# EasyEDA Pro project busmaster-v101.eprj, board main-board
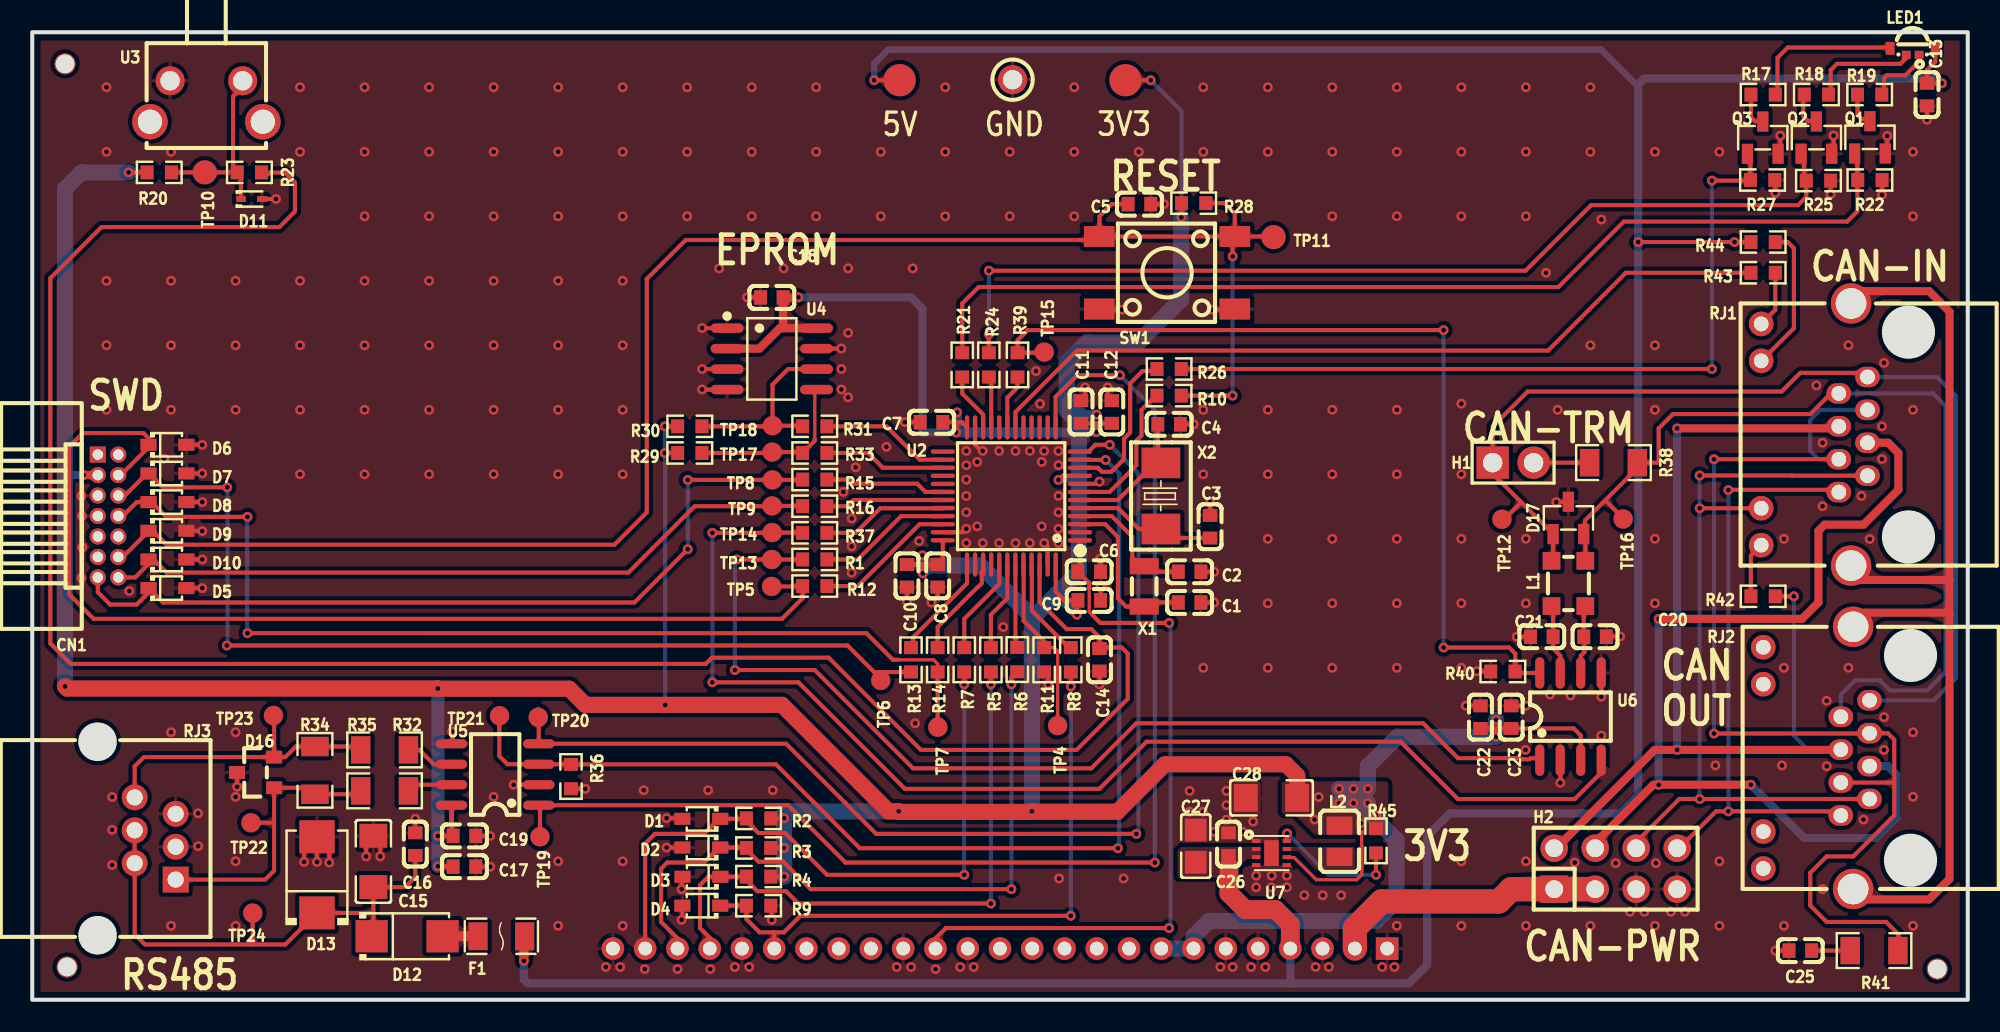
[diagram p6: board, top side]
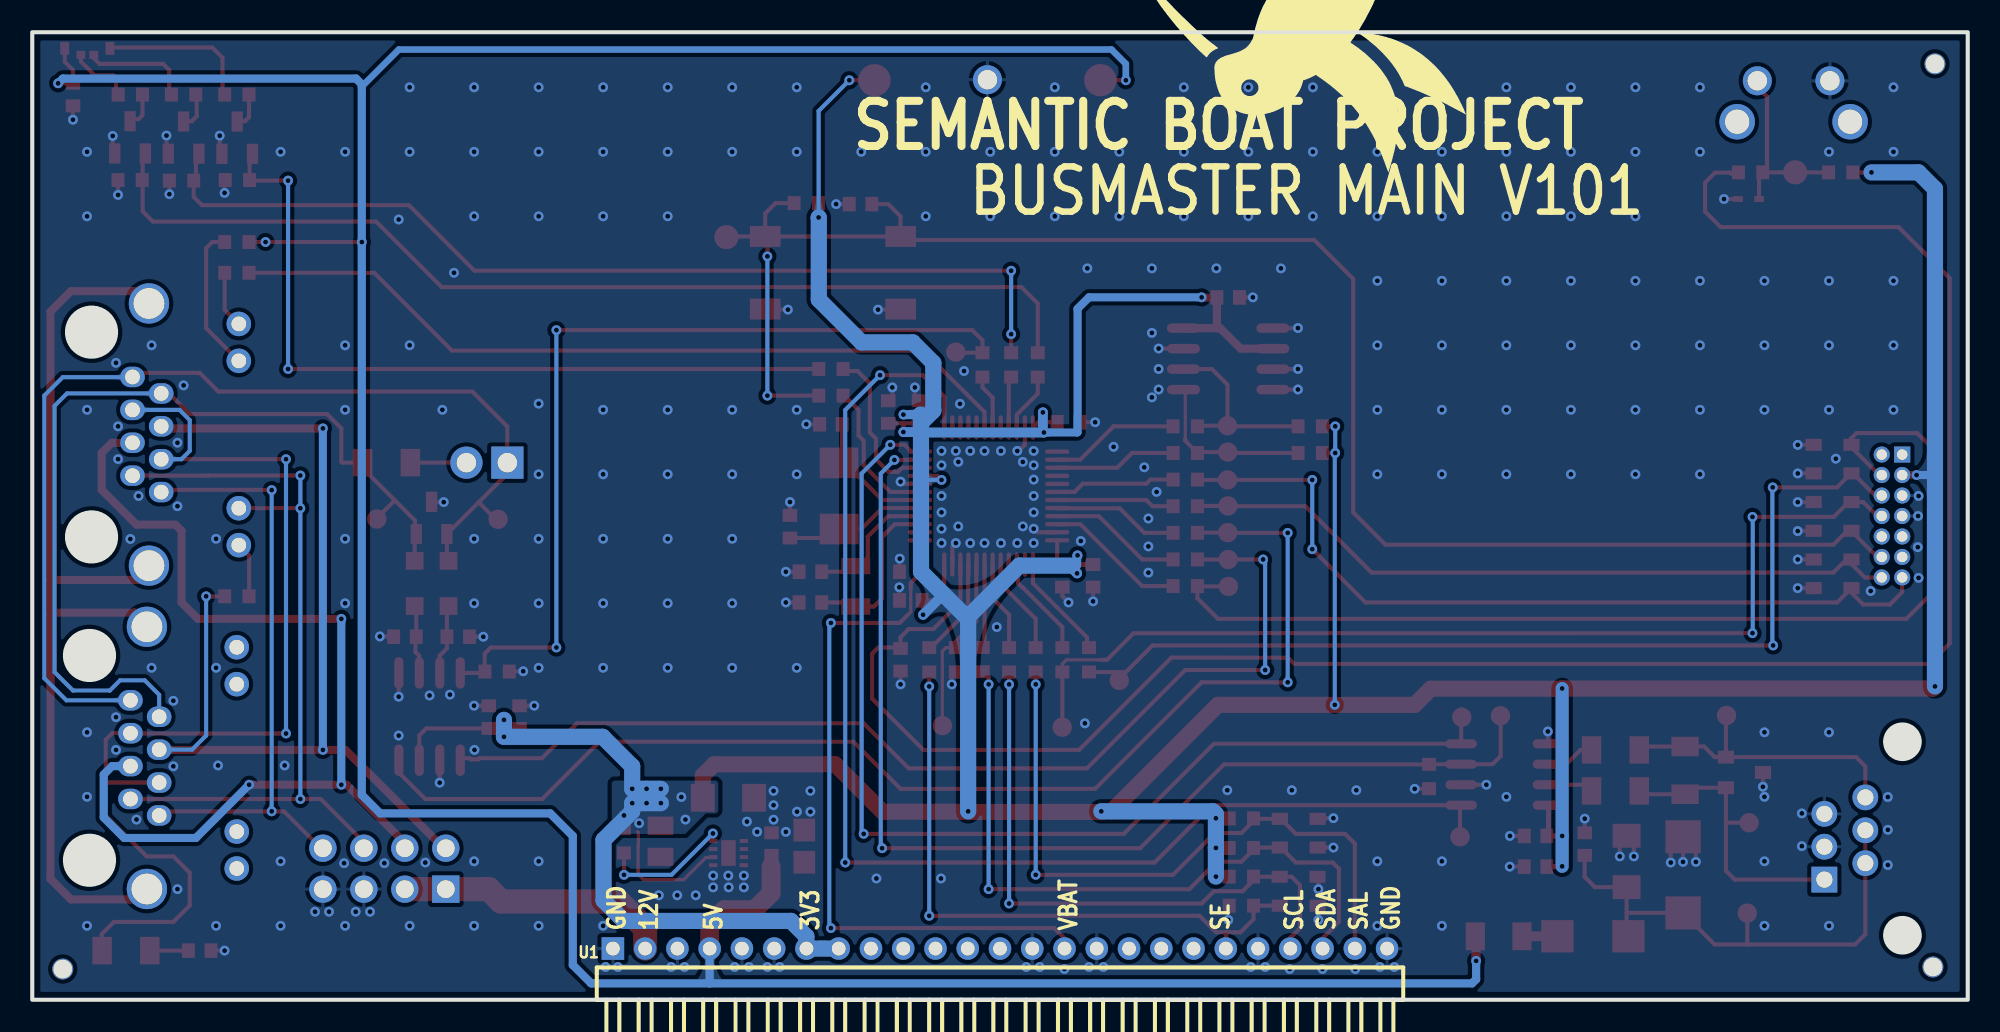
[diagram p7: board, bottom side, seen from below]

Outline 120 x 60 mm; copper layers: Top Layer, Inner1, Inner2, Bottom Layer. Coordinates in mm from the lower left corner of the outline.
Outline path: rectangle 0,60 120,0
Stack: Top Layer 0.035mm Outer layer thickness 1oz / Dielectric1 0.2104mm 7628 RC49% 8.6mil / Inner1 0.0152mm Inner layer thickness / Dielectric2 1.065mm 1.1mm H/HOZ Copper / Inner2 0.0152mm Inner layer thickness / Dielectric3 0.2104mm 7628 RC49% 8.6mil / Bottom Layer 0.035mm Outer layer thickness 1oz

## Design rules (mm)
template: JLCPCB Capability(Two Layers Board)
spacing copperThickness1oz (default): track to track 0.102, other pairs 0.152 to 0.3
spacing copperThickness2oz: track to track 0.203, other pairs 0.152 to 0.3
track width copperThickness1oz (default): min 0.127, default 0.254, max 2.54
track width copperThickness2oz: min 0.203, default 0.254, max 2.54
differential pair differentialPair (default): width min 0.127, default 0.254, max 2.54; gap min 0.152, default 0.152
via viaSize (default): diameter min 0.5, default 0.61, max 10; hole min 0.3, default 0.305, max 6.3

## Placement (name value [footprint] x y rotation side)
C1  22pF  [C0603]  71.75 24.64 180 top
C2  22pF  [C0603]  71.75 26.54 180 top
C3  33pF  [C0603]  73.03 29.34 270 top
C4  33pF  [C0603]  70.49 35.69 180 top
C5  100nF  [C0603]  68.65 49.34 180 top
C6  100nF  [C0603]  65.53 26.54 0 top
C7  100nF  [C0603]  55.75 35.81 0 top
C8  100nF  [C0603]  56.13 26.29 270 top
C9  100nF  [C0603]  65.53 24.77 0 top
C10  4.7uF  [C0603]  54.23 26.29 270 top
C11  100nF  [C0603]  65.02 36.45 90 top
C12  1uF  [C0603]  66.93 36.45 90 top
C13  100nF  [C0603]  117.47 56.13 270 top
C14  100nF  [C0603]  66.17 21.08 90 top
C15  47uF  [C1206]  21.15 8.58 270 top
C16  100nF  [C0603]  23.75 9.65 90 top
C17  1uF  [C0603]  26.8 8.25 180 top
C18  100nF  [C0603]  45.85 43.55 0 top
C19  100nF  [C0603]  26.8 10.16 180 top
C20  47pF  [C0603]  96.89 22.51 0 top
C21  47pF  [C0603]  93.59 22.51 180 top
C22  4.7uF  [C0603]  89.79 17.53 90 top
C23  100pF  [C0603]  91.69 17.53 90 top
C25  100nF  [C0603]  109.62 3.05 0 top
C26  100nF  [C0603]  74.17 9.65 90 top
C27  10uF  [C0805]  72.14 9.53 90 top
C28  22uF  [C1206]  76.84 12.52 180 top
CN1  HX PZ1.27-2x7P WZ  [HDR-TH_14P-P1.27-H-M-R2-C7-S1.27-W7.5-N]  4.7 30 270 top
D1  PESD5V0U1UA,115  [SOD-323_L1.8-W1.3-LS2.5-RD]  41.48 11.22 180 top
D2  PESD5V0U1UA,115  [SOD-323_L1.8-W1.3-LS2.5-RD]  41.48 9.44 180 top
D3  PESD5V0U1UA,115  [SOD-323_L1.8-W1.3-LS2.5-RD]  41.49 7.63 180 top
D4  PESD5V0U1UA,115  [SOD-323_L1.8-W1.3-LS2.5-RD]  41.48 5.83 180 top
D5  PESD5V0U1UA,115  [SOD-323_L1.8-W1.3-LS2.5-RD]  8.38 25.53 0 top
D6  PESD5V0U1UA,115  [SOD-323_L1.8-W1.3-LS2.5-RD]  8.38 34.42 0 top
D7  PESD5V0U1UA,115  [SOD-323_L1.8-W1.3-LS2.5-RD]  8.38 32.64 0 top
D8  PESD5V0U1UA,115  [SOD-323_L1.8-W1.3-LS2.5-RD]  8.38 30.86 0 top
D9  PESD5V0U1UA,115  [SOD-323_L1.8-W1.3-LS2.5-RD]  8.38 29.08 0 top
D10  PESD5V0U1UA,115  [SOD-323_L1.8-W1.3-LS2.5-RD]  8.38 27.31 0 top
D11  PESD3V3S1UB,115  [SOD-523_L1.2-W0.8-LS1.6-RD]  13.59 49.66 0 top
D12  SS34  [SMA_L4.3-W2.6-LS5.2-RD]  23.24 3.94 0 top
D13  SMBJ5.0A  [SMB_L4.6-W3.6-LS5.3-RD]  17.65 7.75 90 top
D16  SM712-02HTG  [SOT-23_L2.9-W1.3-P1.90-LS2.4-BR]  13.84 14.1 0 top
D17  PESD2CAN  [SOT-23-3_L2.9-W1.3-P1.90-LS2.4-BR]  95.24 29.88 270 top
F1  JK-nSMD050-30  [F1206]  29.08 3.94 0 top
H1  PZ254V-11-02P  [HDR-TH_2P-P2.54-V-M]  91.81 33.31 0 top
H2  PZ254V-12-8P  [HDR-TH_8P-P2.54-V-M-R2-C4-S2.54]  98.17 8.13 0 top
L1  WCM3225F2SF-601T10  [FILTER-SMD_4P-L3.2-W2.5-TL_ACM3225]  95.24 25.82 90 top
L2  2.2uH  [IND-SMD_L2.0-W1.6-1]  81.05 9.83 90 top
LED1  MHS110RGBCT  [LED-ARRAY-SMD_MHS110RGBCT]  116.59 58.8 0 top
NOREF  -  [Pad_e5729]  2.16 2.03 0 top
NOREF#2  -  [Pad_e5730]  118.11 1.91 0 top
NOREF#3  -  [Pad_e5731]  2.03 58.04 0 top
Q1  2N7002  [SOT-23-3_L2.9-W1.3-P1.90-LS2.4-BR]  113.94 53.48 270 top
Q2  2N7002  [SOT-23-3_L2.9-W1.3-P1.90-LS2.4-BR]  110.62 53.47 270 top
Q3  2N7002  [SOT-23-3_L2.9-W1.3-P1.90-LS2.4-BR]  107.29 53.46 270 top
R1  0Ω  [R0603]  48.51 27.31 180 top
R2  2.2kΩ  [R0603]  45.03 11.24 0 top
R3  2.2kΩ  [R0603]  45.03 9.42 0 top
R4  2.2kΩ  [R0603]  45.03 7.64 0 top
R5  47Ω  [R0603]  59.44 21.08 270 top
R6  47Ω  [R0603]  61.07 21.09 270 top
R7  47Ω  [R0603]  57.78 21.08 270 top
R8  330Ω  [R0603]  64.39 21.08 270 top
R9  47kΩ  [R0603]  45.03 5.83 180 top
R10  220Ω  [R0603]  70.49 37.47 180 top
R11  47kΩ  [R0603]  62.74 21.08 90 top
R12  47Ω  [R0603]  48.51 25.65 180 top
R13  47Ω  [R0603]  54.48 21.08 270 top
R14  100Ω  [R0603]  56.13 21.08 270 top
R15  100Ω  [R0603]  48.51 32.26 180 top
R16  100Ω  [R0603]  48.51 30.61 180 top
R17  120Ω  [R0603]  107.31 56.13 0 top
R18  100Ω  [R0603]  110.62 56.13 0 top
R19  100Ω  [R0603]  113.92 56.13 0 top
R20  10kΩ  [R0603]  7.87 51.31 180 top
R21  100Ω  [R0603]  57.66 39.37 270 top
R22  100kΩ  [R0603]  113.93 50.84 0 top
R23  1kΩ  [R0603]  13.46 51.31 0 top
R24  100Ω  [R0603]  59.31 39.37 90 top
R25  100kΩ  [R0603]  110.74 50.8 0 top
R26  100Ω  [R0603]  70.49 39.12 0 top
R27  100kΩ  [R0603]  107.28 50.84 0 top
R28  10kΩ  [R0603]  72.01 49.4 180 top
R29  2.2kΩ  [R0603]  40.77 33.91 180 top
R30  2.2kΩ  [R0603]  40.77 35.56 180 top
R31  47Ω  [R0603]  48.51 35.56 180 top
R32  10Ω  [R1206]  21.84 12.95 180 top
R33  47Ω  [R0603]  48.51 33.91 180 top
R34  120Ω  [R1206]  17.53 14.22 270 top
R35  10Ω  [R1206]  21.84 15.49 180 top
R36  100kΩ  [R0603]  33.4 13.84 90 top
R37  0Ω  [R0603]  48.51 28.96 180 top
R38  120Ω  [R1206]  98.04 33.31 180 top
R39  1kΩ  [R0603]  61.09 39.37 90 top
R40  33kΩ  [R0603]  91.18 20.35 0 top
R41  100Ω  [R1206]  114.19 3.05 0 top
R42  4.7kΩ  [R0603]  107.31 25.02 0 top
R43  47Ω  [R0603]  107.31 45.08 180 top
R44  1kΩ  [R0603]  107.31 46.99 180 top
R45  100kΩ  [R0603]  83.31 9.85 90 top
RJ1  R-RJ45R08P-C000  [RJ45-TH_R-RJ45R08P-C000]  110.49 35.05 90 top
RJ2  R-RJ45R08P-C000  [RJ45-TH_R-RJ45R08P-C000]  110.62 15 90 top
RJ3  R-RJ11R06P-A800  [RJ11-TH_PCB-6P6C-90]  7.62 10 270 top
SW1  TS-1002S-05026C  [KEY-SMD_4P-L6.0-W6.0-P4.50-LS9.0]  70.36 45.08 0 top
TP1  RH-5004  [TESTPOINT_TH_BD2.5-D1.2]  60.78 57.06 270 top
TP2  -  [Test-Point-0.5mm#2]  53.78 57.03 270 top
TP3  -  [Test-Point-0.5mm#2]  67.78 57.03 270 top
TP4  -  [Test-Point-0.5mm]  63.57 17 0 top
TP5  -  [Test-Point-0.5mm]  45.84 25.63 0 top
TP6  -  [Test-Point-0.5mm]  52.6 19.8 0 top
TP7  -  [Test-Point-0.5mm]  56.14 16.9 0 top
TP8  -  [Test-Point-0.5mm]  45.89 32.24 0 top
TP9  -  [Test-Point-0.5mm]  45.87 30.62 0 top
TP10  -  [Test-Point-0.5mm#3]  10.7 51.31 180 top
TP11  -  [Test-Point-0.5mm#3]  76.96 47.3 0 top
TP12  -  [Test-Point-0.5mm]  91.12 29.8 90 top
TP13  -  [Test-Point-0.5mm]  45.85 27.3 0 top
TP14  -  [Test-Point-0.5mm]  45.88 28.97 0 top
TP15  -  [Test-Point-0.5mm]  62.74 40.17 0 top
TP16  -  [Test-Point-0.5mm]  98.64 29.81 90 top
TP17  -  [Test-Point-0.5mm]  45.88 33.96 0 top
TP18  -  [Test-Point-0.5mm]  45.9 35.6 0 top
TP19  -  [Test-Point-0.5mm]  31.48 10.1 0 top
TP20  -  [Test-Point-0.5mm]  31.37 17.52 0 top
TP21  -  [Test-Point-0.5mm]  28.97 17.61 0 top
TP22  -  [Test-Point-0.5mm]  13.56 10.98 0 top
TP23  -  [Test-Point-0.5mm]  14.95 17.63 0 top
TP24  -  [Test-Point-0.5mm]  13.67 5.37 0 top
U1  KH-2PH90-1X25P-L10.5  [HDR-TH_25P-P2.00-H-M-W7.5-N]  60 3.18 180 bottom
U2  STM32L431CCT6  [LQFP-48_L7.0-W7.0-P0.50-LS9.0-BL]  60.71 31.24 90 top
U3  TC-6615-9.0-160G  [KEY-TH_PTS645VXX83XLFS]  10.8 55.72 180 top
U4  AT24C256C-SSHL-T  [SOIC-8_L4.9-W3.9-P1.27-LS6.0-BL]  45.85 39.74 270 top
U5  SN65HVD72DR  [SOIC-8_L5.0-W4.0-P1.27-LS6.0-BL]  28.7 13.97 90 top
U6  SN65HVD233DR  [SOIC-8_L5.0-W4.0-P1.27-LS6.0-BL]  95.37 17.56 0 top
U7  TPS62162DSGR  [WSON-8_L2.0-W2.0-P0.50-TL-EP]  76.83 9.1 0 top
X1  32.768kHz  [FC-135R_L3.2-W1.5]  68.94 25.63 270 top
X2  8MHz  [CRYSTAL-SMD_L5.0-W3.2]  69.98 31.24 270 top

## Footprints (pads in the part's own frame, mm; a bottom-side part is the same pattern mirrored in y, then rotated)
C0603
  rect 0.8x0.9 smd: 1(-0.7,0) 2(0.7,0)
C0805
  rect 1.41x1.35 smd: 1(-1,0) 2(1,0)
C1206
  rect 1.485x1.728 smd: 1(-1.593,0) 2(1.593,0)
CRYSTAL-SMD_L5.0-W3.2
  rect 1.9x2.4 smd: 1(-2.05,0) 2(2.05,0)
F1206
  rect 1.19x1.728 smd: 1(-1.445,0) 2(1.445,0)
FC-135R_L3.2-W1.5
  rect 1x1.8 smd: 1(-1.25,0) 2(1.25,0)
FILTER-SMD_4P-L3.2-W2.5-TL_ACM3225
  rect 1.1x1.1 smd: 1(-1.4,1.05) 2(-1.4,-1.05) 3(1.4,-1.05) 4(1.4,1.05)
HDR-TH_2P-P2.54-V-M
  rect 2x2 hole 1.2: 1(-1.27,0)
  round 2 hole 1.2: 2(1.27,0)
HDR-TH_8P-P2.54-V-M-R2-C4-S2.54
  rect 1.7x1.7 hole 1.1: 1(-3.81,-1.27)
  round 1.7 hole 1.1: 2(-3.81,1.27) 3(-1.27,-1.27) 4(-1.27,1.27) 5(1.27,-1.27) 6(1.27,1.27) 7(3.81,-1.27) 8(3.81,1.27)
HDR-TH_14P-P1.27-H-M-R2-C7-S1.27-W7.5-N
  rect 1x1 hole 0.65: 1(-3.81,-0.635)
  round 1 hole 0.65: 2(-3.81,0.635) 3(-2.54,-0.635) 4(-2.54,0.635) 5(-1.27,-0.635) 6(-1.27,0.635) 7(0,-0.635) 8(0,0.635) 9(1.27,-0.635) 10(1.27,0.635) 11(2.54,-0.635) 12(2.54,0.635) 13(3.81,-0.635) 14(3.81,0.635)
HDR-TH_25P-P2.00-H-M-W7.5-N
  rect 1.4x1.4 hole 0.85: 1(-24,0)
  round 1.4 hole 0.85: 2(-22,0) 3(-20,0) 4(-18,0) 5(-16,0) 6(-14,0) 7(-12,0) 8(-10,0) 9(-8,0) 10(-6,0) 11(-4,0) 12(-2,0) 13(0,0) 14(2,0) 15(4,0) 16(6,0) 17(8,0) 18(10,0) 19(12,0) 20(14,0) 21(16,0) 22(18,0) 23(20,0) 24(22,0) 25(24,0)
IND-SMD_L2.0-W1.6-1
  rect 1.133x1.6 smd: 1(-0.967,0) 2(0.967,0)
KEY-SMD_4P-L6.0-W6.0-P4.50-LS9.0
  rect 1.9x1.3 smd: 1(-4.2,2.25) 2(4.2,2.25) 3(-4.2,-2.25) 4(4.2,-2.25)
KEY-TH_PTS645VXX83XLFS
  round 1.8 hole 1.2: 1(-2.25,-1.27) 2(2.25,-1.27)
  round 2.2 hole 1.5: 3(-3.5,1.27) 4(3.5,1.27)
LED-ARRAY-SMD_MHS110RGBCT
  rect 0.55x0.5 smd: 1(0.4,-0.2) 4(-0.4,-0.2)
  rect 0.55x0.8 smd: 2(1.4,0.2) 3(-1.4,0.2)
LQFP-48_L7.0-W7.0-P0.50-LS9.0-BL
  oval 0.27x1.5 smd: 1(-2.75,-4.25) 2(-2.25,-4.25) 3(-1.75,-4.25) 4(-1.25,-4.25) 5(-0.75,-4.25) 6(-0.25,-4.25) 7(0.25,-4.25) 8(0.75,-4.25) 9(1.25,-4.25) 10(1.75,-4.25) 11(2.25,-4.25) 12(2.75,-4.25) 25(2.75,4.25) 26(2.25,4.25) 27(1.75,4.25) 28(1.25,4.25) 29(0.75,4.25) 30(0.25,4.25) 31(-0.25,4.25) 32(-0.75,4.25) 33(-1.25,4.25) 34(-1.75,4.25) 35(-2.25,4.25) 36(-2.75,4.25)
  oval 1.5x0.27 smd: 13(4.25,-2.75) 14(4.25,-2.25) 15(4.25,-1.75) 16(4.25,-1.25) 17(4.25,-0.75) 18(4.25,-0.25) 19(4.25,0.25) 20(4.25,0.75) 21(4.25,1.25) 22(4.25,1.75) 23(4.25,2.25) 24(4.25,2.75) 37(-4.25,2.75) 38(-4.25,2.25) 39(-4.25,1.75) 40(-4.25,1.25) 41(-4.25,0.75) 42(-4.25,0.25) 43(-4.25,-0.25) 44(-4.25,-0.75) 45(-4.25,-1.25) 46(-4.25,-1.75) 47(-4.25,-2.25) 48(-4.25,-2.75)
Pad_e5729
  round 1.3 hole 1.152: 1(0,0)
Pad_e5730
  round 1.3 hole 1.152: 1(0,0)
Pad_e5731
  round 1.3 hole 1.152: 1(0,0)
R0603
  rect 0.806x0.864 smd: 1(-0.753,0) 2(0.753,0)
R1206
  rect 1.208x1.701 smd: 1(-1.479,0) 2(1.479,0)
RJ11-TH_PCB-6P6C-90
  rect 1.6x1.6 hole 1: 1(2.55,1.27)
  round 1.6 hole 1: 2(1.53,-1.27) 3(0.51,1.27) 4(-0.51,-1.27) 5(-1.53,1.27) 6(-2.55,-1.27)
RJ45-TH_R-RJ45R08P-C000
  oval 1.27x1.524 hole 0.914: 1(3.57,-3.295) 2(2.55,-1.515) 3(1.53,-3.295) 4(0.51,-1.515) 5(-0.51,-3.295) 6(-1.53,-1.515) 7(-2.55,-3.295) 8(-3.57,-1.515)
  round 1.524 hole 0.914: 9(-6.86,3.295) 10(-4.57,3.295) 11(4.57,3.295) 12(6.86,3.295)
  round 2.5 hole 1.9: 13(8.13,-2.275) 14(-8.13,-2.275)
SMA_L4.3-W2.6-LS5.2-RD
  rect 2x2 smd: 1(-2.2,0) 2(2.2,0)
SMB_L4.6-W3.6-LS5.3-RD
  rect 2.047x2.192 smd: 1(-2.361,0) 2(2.361,0)
SOD-323_L1.8-W1.3-LS2.5-RD
  rect 1x0.75 smd: 1(-1.173,0) 2(1.173,0)
SOD-523_L1.2-W0.8-LS1.6-RD
  rect 0.6x0.36 smd: 1(-0.65,0) 2(0.65,0)
SOIC-8_L4.9-W3.9-P1.27-LS6.0-BL
  oval 0.588x2.045 smd: 1(-1.905,-2.772) 2(-0.635,-2.772) 3(0.635,-2.772) 4(1.905,-2.772) 5(1.905,2.772) 6(0.635,2.772) 7(-0.635,2.772) 8(-1.905,2.772)
SOIC-8_L5.0-W4.0-P1.27-LS6.0-BL
  oval 0.569x1.95 smd: 1(-1.905,-2.705) 2(-0.635,-2.705) 3(0.635,-2.705) 4(1.905,-2.705) 5(1.905,2.705) 6(0.635,2.705) 7(-0.635,2.705) 8(-1.905,2.705)
SOT-23-3_L2.9-W1.3-P1.90-LS2.4-BR
  rect 1.25x0.7 smd: 1(1,-0.95) 2(1,0.95) 3(-1,0)
SOT-23_L2.9-W1.3-P1.90-LS2.4-BR
  rect 1x0.8 smd: 1(1.15,-0.95) 2(1.15,0.95) 3(-1.15,0)
Test-Point-0.5mm
  round 1.2 smd: 1(0,0)
Test-Point-0.5mm#2
  round 2 smd: 1(0,0)
Test-Point-0.5mm#3
  round 1.5 smd: 1(0,0)
TESTPOINT_TH_BD2.5-D1.2
  round 1.8 hole 1.2: 1(0,0)
WSON-8_L2.0-W2.0-P0.50-TL-EP
  rect 0.521x0.25 smd: 1(-0.95,0.75) 2(-0.95,0.25) 3(-0.95,-0.25) 4(-0.95,-0.75) 5(0.95,-0.75) 6(0.95,-0.25) 7(0.95,0.25) 8(0.95,0.75)
  rect 0.9x1.6 smd: 9(0,0)

## Nets
As in the schematic.

Pads without a net: CN1 1 2 9 10 11; NOREF 1; NOREF#2 1; NOREF#3 1; RJ2 9 10 11 12; U1 9 10 11 12 13 17 18 19; U2 2 14 15 16 17 20 25 28 29 38 40; U3 3 4

## Via types
v1: diameter 0.61, hole 0.305, Top Layer to Bottom Layer, 437 vias

## Routing (per net, layer and track width the routed paths; a pad name or vN(x,y) marks a point on that pad's centre or on a via; arc(x,y) is an arc through that point)
+3V3: length 342.1
  Top Layer w0.203: 82.47,10.42 82.42,10.37 82.42,9.54 82.44,9.52 82.44,8.02 82.42,8 82.42,7.75 82.11,7.45 79.61,7.45 78.24,8.82 77.81,8.82 U7.6
  Top Layer w0.254: 64.77,24.7 64.71,24.77 64.01,24.77 63.46,25.32 U2.48 ; 64.77,24.7 C9.1 ; 64.77,24.7 v1(64.77,23.88) ; v1(46.61,11.25) 46.6,11.24 R2.2 ; U2.24 57.63,35.81 57.25,35.81 ; C12.1 65.99,35.75 ; 65.99,35.75 C11.1 ; 65.99,35.75 v1(65.99,35.2) ; v1(39.22,35.56) R30.2 ; v1(90.75,16.31) 90.75,16.83 ; 90.75,16.83 C23.1 95.57,16.83 96,16.39 U6.3 ; 90.75,16.83 C22.1 ; U2.36 56.46,27.31 C8.1 ; v1(69.34,57.02) 67.78,57.02 TP3.1 ; v1(55.22,26.44) 55.22,26.99 ; v1(46.61,9.41) 45.79,9.41 ; R28.2 71.25,49.39 v1(71.25,48.51) ; 57.25,35.81 57.28,35.79 v1(57.28,35.18) ; 57.25,35.81 C7.2 ; v1(46.61,7.64) R4.2 ; U2.9 63.88,32.49 v1(63.63,32.24) ; v1(39.22,33.91) R29.2 ; v1(5.97,51.31) R20.2
  Top Layer w0.3: C8.1 C10.1
  Top Layer w0.305: v1(25.15,8.27) 25.17,8.25 C17.2 ; U5.8 26,10.26 C19.2 v1(25.15,10.16)
  Top Layer w0.5: CN1.3 v1(3.17,32.54) ; 47.49,43.54 46.55,43.54
  Top Layer w0.508: C18.2 46.55,41.67 46.58,41.65 ; 46.58,41.65 U4.8 ; 46.58,41.65 46.35,41.65 45.08,40.38 U4.2
  Top Layer w1.001: C28.1 78.43,13.9 77.72,14.61 70.23,14.61 67.28,11.66 62,11.66 v1(61.98,11.68) 61.94,11.65 53.76,11.65 v1(53.72,11.68) 53.09,11.68 46.48,18.29 v1(39.24,18.29) 34.29,18.29 33.29,19.29 25.16,19.29 v1(25.15,19.3) 25.14,19.3 2.16,19.3 v1(2.03,19.43)
  Bottom Layer w0.254: v1(69.34,57.02) 71.25,55.12 v1(71.25,48.51) ; v1(63.63,32.24) 64.64,32.24 64.9,32.5 ; v1(39.22,35.56) v1(39.22,33.91) 39.24,33.88 v1(39.24,18.29)
  Bottom Layer w0.5: v1(47.5,43.56) 54.48,43.56 55.19,42.85 55.19,35.2 55.21,35.18 v1(57.28,35.18) ; v1(3.17,32.54) 2.04,32.54 2.03,32.53 ; 55.22,26.92 55.22,27.52
  Bottom Layer w0.559: v1(65.99,36.29) 64.93,36.29
  Bottom Layer w0.595: 55.22,27.52 55.21,27.53
  Bottom Layer w0.61: 55.37,26.92 55.37,26.59 v1(55.22,26.44) ; v1(65.99,35.2) 65.02,35.2 ; 64.9,35.23 64.85,35.18 v1(57.28,35.18) 57.34,35.24 v1(57.34,36.42) ; v1(64.77,23.88) 63.5,25.15
  Bottom Layer w0.813: v1(25.15,8.27) v1(25.15,10.16) v1(25.15,19.3)
  Bottom Layer w1: v1(90.75,17.36) v1(90.75,16.31) 84.63,16.31 82.8,14.48 v1(82.8,13.08) v1(81.91,13.08) v1(81.03,13.08)
  Bottom Layer w1.001: v1(5.97,51.31) 3.05,51.31 2.03,50.29 v1(2.03,19.43) ; 61.98,23.62 61.98,23.75 58.8,26.92 55.63,26.92 ; 61.98,23.62 64.9,26.54 64.9,35.78 ; 61.98,23.62 v1(61.98,11.68) ; 64.9,35.78 64.9,36.25 64.93,36.29 ; 64.9,35.78 64.13,36.54 64.13,39.5 65.41,40.77 68.58,40.77 71.23,43.42 71.23,48.5 v1(71.25,48.51) ; U1.8 U1.7 72.01,3.18 72.01,3.94 72.96,4.89 83.31,4.89 84.58,6.16 84.58,9.91 82.8,11.68 v1(82.8,12.19) v1(81.91,12.19) v1(81.03,12.19) ; v1(53.72,11.68) 46.79,11.68 46.61,11.51 v1(46.61,11.25) v1(46.61,9.41) v1(46.61,7.64)
  vias: v1(55.19,27.56) v1(79.5,11.18) v1(79.76,12.57) v1(82.37,10.95) v1(83.31,11.43)
+5V: length 216.1
  Top Layer w0.254: v1(99.57,46.99) v1(105.54,46.99) R44.2 ; TP2.1 53.78,57.02 v1(52.2,57.02) ; v1(118.4,56.83) C13.1 117.47,57.66 117.99,58.17 LED1.2
  Top Layer w0.559: F1.2 30.48,3.89 v1(30.48,2.41)
  Top Layer w1.169: U1.4 78,4.68 77.09,5.59 75.21,5.59 74.19,6.6 74.19,8.25
  Bottom Layer w0.406: 99.57,56.63 97.27,58.93 53.09,58.93 52.2,58.04 v1(52.2,57.02)
  Bottom Layer w0.508: 78.01,1.02 78,1.03 U1.4 ; 78.01,1.02 85.34,1.02 86.49,2.16 86.49,10.16 87.88,11.56 98.43,11.56 99.57,12.7 v1(99.57,46.99) 99.57,56.77 99.93,57.13 118.1,57.13 v1(118.4,56.83) ; 78.01,1.02 30.73,1.02 30.48,1.27 v1(30.48,2.41)
+12V: length 17.2
  Top Layer w1.501: U1.2 82,4.44 83.65,6.1 90.93,6.1 91.69,6.86 H2.1 H2.3
GND: length 70.3
  Top Layer w0.254: D16.3 12.7,14.09 v1(12.7,13.21) ; 73.02,30.07 73.03,30.07 v1(73.03,30.87) ; v1(108.08,50.04) 108.08,50.79 R27.2 ; v1(65.28,37.97) 65.28,37.4 C11.2 ; U2.8 66.03,31.99 v1(66.17,32.13) ; v1(66.68,37.97) 66.68,37.4 C12.2 ; R22.2 114.69,49.92 v1(114.68,49.91) ; R36.1 34.28,13.09 v1(34.29,13.08) ; v1(54.23,24.71) C10.2 ; C23.2 91.71,18.24 v1(92.61,18.24) ; v1(50.16,40.39) 50.16,40.38 U4.7 ; v1(94.49,30.86) 95.22,30.86 D17.3 ; D11.2 v1(15.11,49.66) ; D8.2 v1(10.54,30.86) ; v1(98.45,22.53) 97.61,22.53 C20.2 ; v1(40.26,4.95) 40.31,5 D4.2 ; v1(41.53,41.66) 41.54,41.65 U4.1 ; v1(108.08,3.05) C25.1 ; v1(21.58,8.89) 21.58,9.74 C15.1 20.7,9.72 v1(20.7,8.89) ; v1(73.15,42.8) 74.52,42.8 SW1.4 ; v1(92.03,22.51) C21.2 ; v1(66.24,25.58) 66.24,24.78 C9.2 ; v1(97.28,18.8) 97.28,20.26 U6.5 ; D6.2 10.53,34.42 v1(10.54,34.41) ; v1(17.65,8.55) D13.2 ; D13.2 18.42,9.35 v1(18.42,8.51) ; D13.2 16.86,9.31 v1(16.86,8.55) ; v1(28.39,10.16) C19.1 ; v1(111.68,53.59) 111.68,52.58 111.57,52.47 ; R40.1 90.41,20.37 v1(89.56,20.37) ; R9.1 45.85,5.77 v1(45.85,4.95) ; U2.35 57.69,28.99 v1(57.91,29.21) ; v1(66.17,19.56) C14.1 ; v1(29.84,13.33) U5.2 ; D7.2 v1(10.54,32.64) ; SW1.3 66.19,42.8 v1(67.56,42.8) ; C4.1 v1(72.01,35.69) ; v1(44.32,43.56) 45.15,43.56 C18.1 ; v1(115.01,53.57) 115.01,52.61 Q1.2 ; v1(73.28,26.54) 72.46,26.54 ; v1(26.03,16.64) 26.03,15.91 U5.5 ; v1(94.74,13.46) 94.74,14.85 U6.2 ; U2.47 62.96,28.1 v1(62.74,28.32) ; v1(10.54,29.07) 10.52,29.08 D9.2 ; v1(62.99,19.56) 62.99,20.07 R11.1 ; C6.2 66.23,27.34 v1(66.22,27.36) ; v1(54.1,35.81) C7.1 ; v1(58.93,34.04) 58.84,34.04 58.46,34.42 U2.23 ; v1(88.87,18.24) 89.78,18.24 C22.2 ; v1(41.53,39.12) 41.54,39.11 U4.3 ; v1(41.53,37.85) 41.54,37.84 U4.4 ; v1(40.26,6.86) 40.26,7.57 D3.2 ; D5.2 v1(10.54,25.53) ; v1(55.75,24.64) 56.13,25.02 C8.2 ; v1(28.4,8.25) C17.1 ; v1(70.16,49.34) C5.1 ; v1(108.38,53.59) 108.38,52.6 Q3.2 ; D10.2 v1(10.54,27.31) ; v1(39.33,9.44) D2.2 ; D1.2 40.27,11.26 v1(39.33,11.26) ; v1(23.75,11.23) C16.2 ; v1(73.28,24.64) 72.46,24.64 ; v1(117.47,54.58) C13.2 ; v1(111.5,49.96) R25.2
  vias: v1(3.05,31.24) v1(3.05,26.16) v1(3.08,30) v1(3.1,28.07) v1(4.6,56.59) v1(4.6,52.59) v1(4.6,44.59) v1(4.6,40.59) v1(4.6,36.59) v1(4.95,12.57) v1(4.95,10.54) v1(4.95,8.36) v1(6.02,25.35) v1(8.18,33.55) v1(8.6,52.59) v1(8.6,44.59) v1(8.6,40.59) v1(8.6,36.59) v1(8.6,16.59) v1(8.6,4.59) v1(10.29,11.56) v1(10.29,9.53) v1(12.6,44.59) v1(12.6,40.59) v1(12.6,36.59) v1(12.6,16.59) v1(12.6,12.59) v1(12.6,8.59) v1(12.6,4.59) v1(16.6,56.59) v1(16.6,52.59) v1(16.6,44.59) v1(16.6,40.59) v1(16.6,36.59) v1(16.6,32.59) v1(20.6,56.59) v1(20.6,52.59) v1(20.6,48.59) v1(20.6,44.59) v1(20.6,40.59) v1(20.6,36.59) v1(20.6,32.59) v1(24.6,56.59) v1(24.6,52.59) v1(24.6,48.59) v1(24.6,44.59) v1(24.6,40.59) v1(24.6,36.59) v1(24.6,32.59) v1(28.6,56.59) v1(28.6,52.59) v1(28.6,48.59) v1(28.6,44.59) v1(28.6,40.59) v1(28.6,36.59) v1(28.6,32.59) v1(28.6,12.59) v1(32.6,56.59) v1(32.6,52.59) v1(32.6,48.59) v1(32.6,44.59) v1(32.6,40.59) v1(32.6,36.59) v1(32.6,32.59) v1(32.6,8.59) v1(32.6,4.59) v1(35.56,2.03) v1(36.45,2.03) v1(36.6,56.59) v1(36.6,52.59) v1(36.6,48.59) v1(36.6,44.59) v1(36.6,40.59) v1(36.6,36.59) v1(36.6,32.59) v1(36.6,8.59) v1(36.6,4.59) v1(37.91,12.99) v1(37.97,1.91) v1(40,1.91) v1(40.6,56.59) v1(40.6,52.59) v1(40.6,48.59) v1(41.91,12.99) v1(42.04,1.91) v1(42.59,45.36) v1(43.56,2.03) v1(44.45,2.03) v1(44.6,56.59) v1(44.6,52.59) v1(44.6,48.59) v1(45.91,12.99) v1(46.59,45.36) v1(48.6,56.59) v1(48.6,52.59) v1(48.6,48.59) v1(50.16,39.12) v1(50.16,37.85) v1(50.29,31.5) v1(50.59,45.36) v1(50.59,41.36) v1(50.59,37.36) v1(50.8,29.84) v1(50.8,28.11) v1(50.8,26.49) v1(51.05,33.02) v1(52.6,52.59) v1(52.6,48.59) v1(52.96,34.29) v1(53.59,2.03) v1(54.48,2.03) v1(54.59,45.36) v1(54.74,17.14) v1(54.99,28.45) v1(56.01,1.91) v1(56.6,56.59) v1(56.6,52.59) v1(56.6,48.59) v1(57.53,2.03) v1(57.91,34.04) v1(57.91,33.15) v1(57.91,32.26) v1(57.91,31.24) v1(57.91,30.23) v1(57.91,28.32) v1(58.37,2.03) v1(58.59,33.36) v1(58.59,29.36) v1(58.93,28.32) v1(59.94,34.04) v1(59.94,28.32) v1(60.2,23.11) v1(60.6,52.59) v1(60.6,48.59) v1(60.96,34.04) v1(60.96,28.32) v1(61.85,34.04) v1(61.85,28.32) v1(62.23,38.99) v1(62.48,36.96) v1(62.59,33.36) v1(62.59,29.36) v1(62.74,34.04) v1(63.63,34.04) v1(63.63,33.15) v1(63.63,31.24) v1(63.63,30.23) v1(63.63,29.21) v1(63.63,28.32) v1(63.66,7.52) v1(64.6,56.59) v1(64.6,52.59) v1(64.6,48.59) v1(67.66,7.52) v1(68.6,52.59) v1(71.75,12.95) v1(71.75,11.66) v1(72.6,56.59) v1(72.6,52.59) v1(72.6,36.59) v1(72.6,32.59) v1(72.6,20.59) v1(72.59,11.66) v1(73.28,10.41) v1(73.66,2.03) v1(74.04,12.95) v1(74.04,12.06) v1(74.04,11.17) v1(74.42,2.03) v1(75.06,10.41) v1(75.56,2.03) v1(75.69,11.05) v1(75.88,7.7) v1(75.88,6.97) v1(76.45,2.03) v1(76.6,56.59) v1(76.6,52.59) v1(76.6,36.59) v1(76.6,32.59) v1(76.6,28.59) v1(76.6,24.59) v1(76.6,20.59) v1(76.84,7.7) v1(76.82,6.97) v1(77.78,7.7) v1(77.79,6.97) v1(78.87,6.48) v1(79.56,2.03) v1(80.01,6.48) v1(80.39,2.03) v1(80.6,56.59) v1(80.6,52.59) v1(80.6,48.59) v1(80.6,36.59) v1(80.6,32.59) v1(80.6,28.59) v1(80.6,24.59) v1(80.6,20.59) v1(81.15,6.48) v1(83.69,2.03) v1(84.46,2.03) v1(84.6,56.59) v1(84.6,52.59) v1(84.6,48.59) v1(84.6,36.59) v1(84.6,32.59) v1(84.6,28.59) v1(84.6,24.59) v1(84.6,20.59) v1(84.6,4.59) v1(88.6,56.59) v1(88.6,52.59) v1(88.6,48.59) v1(88.6,36.97) v1(88.6,32.59) v1(88.6,28.59) v1(88.6,24.59) v1(88.6,20.59) v1(88.6,8.59) v1(88.6,4.59) v1(92.6,56.59) v1(92.6,52.59) v1(92.6,48.59) v1(92.6,28.59) v1(92.6,24.59) v1(92.58,15.49) v1(92.6,8.59) v1(92.6,4.59) v1(93.85,45.08) v1(94.11,18.92) v1(94.57,36.59) v1(95.37,18.87) v1(95.63,8.51) v1(96.6,56.59) v1(96.6,52.59) v1(96.6,40.59) v1(96.6,4.59) v1(97.28,48.39) v1(97.28,16.38) v1(98.17,8.47) v1(99.06,5.46) v1(99.95,5.46) v1(100.6,52.59) v1(100.6,40.59) v1(100.6,36.59) v1(100.6,28.59) v1(100.6,24.59) v1(100.6,4.59) v1(100.67,8.47) v1(101.6,5.46) v1(102.47,5.46) v1(104.35,14.53) v1(104.6,52.59) v1(104.6,8.59) v1(104.6,4.59) v1(108.48,14.53) v1(108.6,28.59) v1(108.6,20.59) v1(108.6,4.59) v1(110.62,38.1) v1(111,34.54) v1(111,30.61) v1(111,6.86) v1(111.25,18.54) v1(111.25,14.48) v1(112.6,40.59) v1(112.6,20.59) v1(113.41,31.24) v1(113.54,11.18) v1(113.92,28.58) v1(114.68,35.56) v1(114.68,33.53) v1(114.81,39.5) v1(114.81,17.53) v1(114.81,15.49) v1(116.6,52.59) v1(116.6,48.59) v1(116.6,36.59) v1(116.6,16.59) v1(116.6,12.59) v1(116.6,4.59)
VBAT: length 44.4
  Top Layer w0.203: 65.72,23.87 65.53,24.05 65.53,25.53
  Top Layer w0.254: U2.1 64.96,26.67 C6.1 65.53,25.84 65.53,25.53 ; v1(70.49,23.37) 66.22,23.37 65.72,23.87 ; U1.15 56,3.8 56.64,4.44 v1(70.49,4.44)
  Bottom Layer w0.254: v1(70.49,23.37) 70.58,23.27 70.58,4.54 v1(70.49,4.44)
485_A: length 18.6
  Top Layer w0.254: 14.99,10.94 14.96,10.98 TP22.1 ; 14.99,10.94 14.99,8 14.44,7.45 RJ3.1 ; 14.99,10.94 14.99,13.15 17.12,13.15 R34.2 20.16,12.75 R32.2
485_B: length 19.1
  Top Layer w0.254: 14.99,15.05 6.92,15.05 6.35,14.48 RJ3.6 ; 14.99,15.05 15.68,15.05 16.34,15.7 R34.1 20.16,15.7 R35.2 ; 14.99,15.05 14.99,17.59 TP23.1
BTN_FUNCTION_0: length 127.1
  Top Layer w0.254: 14.33,51.24 14.68,51.24 14.74,51.3 15.66,51.3 16.29,50.67 16.29,48.88 15.32,47.92 4.29,47.92 1.12,44.75 1.12,22.1 2.39,20.83 41.75,20.83 42.13,21.21 49.37,21.22 55.1,15.49 64.75,15.49 67.92,18.67 67.92,21.46 67.54,21.84 66.59,21.84 66.53,21.78 C14.2 66.17,22.48 65.66,22.99 64.13,22.99 62.46,24.67 U2.46
CAN_ACTIVE: length 50.1
  Top Layer w0.254: R43.2 98.81,45.08 93.98,40.26 64.77,40.26 60.96,36.45 60.96,35.5 U2.18
CAN_H: length 65.7
  Top Layer w0.254: 92.32,30.85 91.26,29.8 TP12.1 ; 92.32,30.85 90.54,32.63 90.54,33.31 90.55,33.32 90.55,35.56 92.71,37.72 108.46,37.72 109.62,38.88 113.53,38.88 RJ1.1 ; 92.32,30.85 D17.1 94.29,27.32 L1.4
  Bottom Layer w0.254: RJ1.1 113.8,38.61 118.11,38.61 119.25,37.47 119.25,19.94 117.88,18.57 RJ2.1
CAN_L: length 57
  Top Layer w0.254: RJ1.2 111.52,37.6 110.24,36.32 101.73,36.32 100.84,35.43 100.84,33.36 100.78,33.31 R38.1 99.51,32.97 97.52,30.97 ; TP16.1 98.64,29.86 97.52,30.97 ; 97.52,30.97 96.27,29.72 96.27,28.95 D17.2 96.29,28.78 L1.3
  Bottom Layer w0.254: RJ2.2 112.13,18.91 113.03,19.81 114.55,19.81 115.19,19.18 117.47,19.18 118.62,20.32 118.62,36.83 117.85,37.6 RJ1.2
CAN_MUTE: length 3.4
  Top Layer w0.254: R39.1 61.09,37.97 60.46,37.34 U2.19
CAN_RX: length 7.8
  Top Layer w0.254: R37.1 51.05,28.96 52.58,30.48 56.44,30.48 U2.32
CAN_TX: length 8.3
  Top Layer w0.254: R1.1 51.18,27.31 53.87,29.99 U2.33
I2C_SCL: length 12
  Top Layer w0.254: R30.1 45.86,35.56 TP18.1 ; TP18.1 47.72,35.6 R31.2 ; TP18.1 45.9,38.15 46.86,39.12 47.12,39.12 47.12,39.11 U4.6
I2C_SDA: length 10.6
  Top Layer w0.203: 48.51,34.8 48.51,37.73 U4.5
  Top Layer w0.254: R29.1 45.82,33.91 TP17.1 47.71,33.96 R33.2 48.51,34.66 48.51,34.8
MCU_485_DE: length 69.7
  Top Layer w0.254: U2.11 64.97,33.48 v1(66.55,33.48) ; v1(67.31,9.4) 51.31,9.4 46.11,14.6 R36.2 33.39,14.61 U5.3 29.46,14.61 28.96,15.11 28.96,17.98 28.97,17.99
  Bottom Layer w0.254: v1(66.55,33.48) 67.39,32.63 67.39,9.48 v1(67.31,9.4)
MCU_485_RX: length 79.2
  Top Layer w0.254: v1(69.6,8.51) 50.42,8.51 46.86,12.06 U5.1 31.48,11.99 TP19.1 ; U2.13 63.45,35.5 63.45,37.39 64.8,38.73 v1(67.44,38.73)
  Bottom Layer w0.254: v1(69.6,8.51) 69.6,36.58 v1(67.44,38.73)
MCU_485_TX: length 68.5
  Top Layer w0.254: v1(68.45,10.29) 52.32,10.29 46.74,15.88 U5.4 31.41,17.99 31.37,18.03 ; U2.12 65.49,33.99 65.91,34.42 v1(66.8,34.42)
  Bottom Layer w0.254: v1(68.45,10.29) 68.58,10.41 68.58,32.64 v1(66.8,34.42)
MCU_I2C_SCL: length 8
  Top Layer w0.254: U2.26 55.03,33.49 52.96,35.56 R31.1
MCU_I2C_SDA: length 7.6
  Top Layer w0.254: U2.27 52.73,32.99 51.82,33.91 R33.1
MCU_SMB_CLK: length 5.6
  Top Layer w0.254: R5.1 59.44,23.88 60.46,24.9 U2.42
MCU_SMB_DATA: length 5.2
  Top Layer w0.254: 61.09,21.86 R6.1 60.96,21.96 U2.43
MCU_STACK_ENABLE: length 6.2
  Top Layer w0.254: U2.45 61.98,26.97 61.98,24.13 64.27,21.84 R8.1
RESET: length 109
  Top Layer w0.254: SW1.2 74.42,47.2 v1(74.42,46.1) ; SW1.2 74.56,48.76 73.91,49.4 R28.1 ; SW1.2 76.87,47.33 76.96,47.24 ; SW1.2 SW1.1 ; CN1.12 5.62,27.46 7.21,29.05 D9.1 7.47,29.08 8.33,28.22 36.09,28.22 38.1,30.23 38.1,44.7 40.51,47.12 65.94,47.12 SW1.1 ; 67.94,49.34 66.93,49.34 66.17,48.58 66.17,47.34 SW1.1 ; R10.1 v1(74.42,37.47)
  Bottom Layer w0.254: v1(74.42,37.47) v1(74.42,46.1)
SMB_ALERT: length 41.1
  Top Layer w0.254: v1(57.78,7.75) 49.28,7.75 46.69,10.34 45.03,10.34 44.28,11.09 R2.1 44.26,11.22 42.59,11.22 41.66,10.29 38.61,10.29 38,9.68 U1.24 ; v1(57.78,19.56) R7.2
  Bottom Layer w0.254: v1(57.78,7.75) v1(57.78,19.56)
SMB_CLK: length 37.6
  Top Layer w0.254: v1(59.44,5.97) 47.5,5.97 46.74,6.73 44.96,6.73 44.28,7.41 R4.1 44.27,7.63 D3.1 41.92,7.63 41.4,7.11 41.4,4.44 42,3.85 U1.22 ; v1(59.44,19.56) R5.2
  Bottom Layer w0.254: v1(59.44,5.97) v1(59.44,19.56)
SMB_DATA: length 42.4
  Top Layer w0.254: v1(60.71,19.56) 60.71,19.98 R6.2 ; v1(60.71,6.86) 48.26,6.86 46.56,8.56 45.03,8.56 44.28,9.31 R3.1 44.26,9.44 42.59,9.44 41.66,8.51 39.37,8.51 38.99,8.13 38.99,4.83 40,3.81 U1.23
  Bottom Layer w0.254: v1(60.71,6.86) v1(60.71,19.56)
SMU_SMB_ALERT: length 6.1
  Top Layer w0.254: U2.41 59.96,25.79 57.78,23.62 R7.1
STACK_ENABLE: length 40.5
  Top Layer w0.254: v1(64.39,5.21) 47.62,5.21 46.6,4.18 45.97,4.18 ; 42.65,5.83 R9.2 44.28,5 45.09,4.18 45.97,4.18 ; 45.97,4.14 46,4.12 U1.20 45.97,3.2 45.97,4.14 ; 45.97,4.14 45.97,4.18 ; v1(64.39,19.43) R8.2
  Bottom Layer w0.254: v1(64.39,5.21) v1(64.39,19.43)
STATUS_LED_BLU: length 3.7
  Top Layer w0.254: U2.22 58.96,36.29 57.66,37.59 R21.2
STATUS_LED_GRN: length 3.2
  Top Layer w0.254: R24.1 59.46,38.47 U2.21
STATUS_LED_RED: length 10.1
  Top Layer w0.254: U2.10 66.07,32.99 66.32,32.74 66.9,32.74 67.69,33.53 67.69,34.8 68.07,35.18 68.07,38.23 68.83,38.99 69.6,38.99 R26.1
STL_COM_RX: length 7.5
  Top Layer w0.254: U2.30 55.38,31.49 54.86,32 50.93,32 50.67,32.26 R15.1
STL_COM_TX: length 7.3
  Top Layer w0.254: U2.31 50.93,30.99 50.55,30.61 R16.1
SWCLK: length 6.6
  Top Layer w0.254: U2.37 57.96,25.83 54.61,22.48 54.61,21.96 R13.1
SWDIO: length 8.8
  Top Layer w0.254: R12.1 51.18,25.65 55.02,29.49 U2.34
TRACESWO: length 6.3
  Top Layer w0.254: U2.39 58.96,26.61 58.87,26.53 58.87,25.82 58.63,25.58 58.6,25.58 56.13,23.11 R14.1
VAUX+: length 63.4
  Top Layer w0.254: v1(109.22,25.02) 108.09,25.02 108.08,25.01 R42.2
  Top Layer w0.5: RJ2.4 112.12,15.49 v1(101.98,15.49) 100.58,15.49 94.49,9.4 H2.2 ; RJ1.4 111.88,35.43 v1(101.98,35.43)
  Bottom Layer w0.254: v1(109.22,25.02) 109.22,16.38 110.09,15.51 RJ2.4
  Bottom Layer w0.5: v1(101.98,35.43) v1(101.98,15.49)
VAUX+2: length 62.5
  Top Layer w0.5: v1(106.55,13.33) v1(100.84,13.33) 100.51,13.33 96.9,9.73 H2.4 ; RJ1.5 115.06,34.54 115.7,33.91 115.7,31.62 113.54,29.46 111.12,29.46 110.74,29.08 110.74,24.64 109.73,23.62 v1(100.84,23.62)
  Bottom Layer w0.5: v1(106.55,13.33) 109.85,10.03 114.3,10.03 115.57,11.3 115.57,13.97 115.05,14.49 RJ2.5 ; v1(100.84,13.33) v1(100.84,23.62)
VAUX-: length 50.3
  Top Layer w0.254: v1(103.38,30.48) 103.38,30.48 RJ1.10 ; v1(103.38,32.51) 109.09,32.51 109.1,32.5 RJ1.7 ; RJ2.7 104.2,12.45 104.19,12.45 v1(103.38,12.45) ; H2.6 99.44,9.78 102.11,12.45 103.38,12.45
  Bottom Layer w0.254: v1(103.38,32.51) v1(103.38,30.48) v1(103.38,12.45)
VAUX-2: length 37.9
  Top Layer w0.254: v1(105.16,31.61) 105.17,31.62 111.5,31.62 111.65,31.48 RJ1.8 ; RJ2.8 111.88,11.68 v1(105.16,11.68) 104.39,11.68 102.11,9.4
  Bottom Layer w0.254: v1(105.16,31.61) v1(105.16,11.68)
$1N4329: length 8.8
  Top Layer w0.254: U2.5 67.31,30.49 68.61,29.19 X2.2 70.53,28.64 C3.2
$1N4330: length 8.4
  Top Layer w0.254: 69.78,35.69 69.78,33.48 X2.1 69.61,33.29 67.31,30.99 U2.6
$1N4744: length 10.6
  Top Layer w0.254: U2.3 66.52,29.49 67.31,28.7 67.31,24.89 67.82,24.38 X1.2 69.19,24.64 C1.2
$1N4748: length 8.3
  Top Layer w0.254: U2.4 66.93,29.99 68.2,28.72 68.2,27.43 68.75,26.88 X1.1 69.28,26.54 C2.2
$1N5436: length 63.8
  Top Layer w0.203: R14.2 56.13,20.83 55.88,21.08 53.72,21.08
  Top Layer w0.254: 53.72,21.08 53.36,21.08 51.71,22.73 v1(13.35,22.73) ; R14.2 56.13,16.59 ; CN1.8 5.62,30 6.48,30.86 D8.1 7.39,30.86 8.31,29.95 v1(13.35,29.95)
  Bottom Layer w0.254: v1(13.35,22.73) 13.33,22.75 13.33,29.93 v1(13.35,29.95)
$1N5439: length 51.6
  Top Layer w0.254: v1(40.64,32.24) TP8.1 47.74,32.24 R15.2 ; v1(40.64,27.94) 37.34,24.64 8.1,24.64 D5.1 7.21,25.24 6.48,24.51 4.83,24.51 4.06,25.27 CN1.13
  Bottom Layer w0.254: v1(40.64,32.24) v1(40.64,27.94)
$1N5442: length 60.7
  Top Layer w0.254: v1(12.06,21.97) 50.55,21.97 52.2,20.32 53,20.32 ; 52.99,20.31 53,20.32 ; 53,20.32 54.47,20.32 ; v1(12.09,31.78) 8.1,31.78 7.24,32.64 D7.1 7.11,32.64 5.74,31.27 CN1.6 ; 54.47,20.32 54.48,20.32 R13.2 54.47,20.32
  Bottom Layer w0.254: v1(12.06,21.97) 12.11,22.02 12.11,31.75 v1(12.09,31.78)
$1N5443: length 67
  Top Layer w0.254: CN1.4 5.49,32.54 7.21,34.26 7.21,34.36 7.23,34.81 6.9,35.14 3.14,35.14 2.29,34.29 2.29,25.15 3.81,23.62 46.48,23.62 47.76,24.9 R12.2 47.74,25.63 TP5.1
$1N5454: length 45.1
  Top Layer w0.254: CN1.14 6.38,26.19 7.21,27.02 D10.1 7.52,27.31 8.33,26.49 36.96,26.49 41.07,30.61 45.85,30.61 TP9.1 47.74,30.62 R16.2
$1N6636: length 11.9
  Top Layer w0.254: R23.1 12.94,51.08 D11.1 ; U3.1 13.05,56.61 12.45,56.01 12.45,51.57 12.7,51.31 TP10.1 10.69,51.31 R20.1
$1N6640: length 48.7
  Top Layer w0.254: R26.2 v1(104.14,39.12) ; v1(104.14,50.8) 106.49,50.8 R27.1 106.53,52.28 Q3.1
  Bottom Layer w0.254: v1(104.14,39.12) v1(104.14,50.8)
$1N6642: length 60.5
  Top Layer w0.254: v1(59.31,45.21) 92.58,45.21 96.65,49.28 109.47,49.28 109.99,49.79 R25.1 109.85,50.94 109.85,52.28 Q2.1 ; R24.2 v1(59.31,41.28)
  Bottom Layer w0.254: v1(59.31,45.21) v1(59.31,41.28)
$1N6643: length 64.6
  Top Layer w0.254: R21.1 57.66,43.18 58.67,44.2 94.62,44.2 98.68,48.26 112.52,48.26 113.16,48.89 113.16,50.81 R22.1 113.16,50.86 113.16,52.31 Q1.1
$1N6645: length 2.2
  Top Layer w0.254: Q3.3 107.27,54.48 106.81,54.48 106.56,54.73 R17.1
$1N6646: length 2.3
  Top Layer w0.254: Q2.3 110.6,54.48 110.11,54.48 109.8,54.79 109.8,56.07 R18.1
$1N6647: length 4.1
  Top Layer w0.254: R19.2 114.81,56.27 114.81,57.15 114.99,57.33 116.13,57.33 116.99,58.19 LED1.1
$1N6648: length 6.8
  Top Layer w0.254: LED1.4 116.19,58.4 115.82,58.04 111.89,58.04 111.51,57.66 111.51,56.27 R18.2
$1N6649: length 9.6
  Top Layer w0.254: LED1.3 115.13,59.06 108.84,59.06 108.2,58.42 108.2,56.27 R17.2
$1N6650: length 2.2
  Top Layer w0.254: R19.1 113.17,54.86 113.41,54.61 113.81,54.61 Q1.3
$1N26550: length 2.8
  Top Layer w0.254: U5.7 23.7,13.33 R32.1
$1N26601: length 3
  Top Layer w0.254: R35.1 24,15.49 24.89,14.61 U5.6
$1N26770: length 31.6
  Top Layer w0.254: RJ3.4 RJ3.2 6.35,4.06 6.98,3.43 13.66,3.43 ; 13.66,3.43 13.67,3.44 TP24.1 ; 13.66,3.43 15.7,3.43 D13.1 21.14,5.39 21.15,5.37 ; 21.15,5.37 C15.2 23.11,6.99 23.75,7.62 C16.1 ; 21.15,5.37 21.15,4.05 D12.1
$1N27136: length 2.2
  Top Layer w0.61: D12.2 F1.1
$1N35622: length 9.1
  Top Layer w0.254: U2.7 66.8,31.49 68.45,33.15 68.45,34.67 68.77,34.99 68.77,36.58 69.66,37.47 R10.2
$1N35628: length 10.9
  Top Layer w0.2: 63.58,17.33 63.58,21.62 63.36,21.84 R11.2
  Top Layer w0.254: R11.2 62.74,22.22 61.47,23.5 61.47,26.98 U2.44
$1N53853: length 8.4
  Top Layer w0.254: v1(83.31,7.75) R45.1 ; U7.8 77.78,10.29 v1(77.8,10.31)
  Bottom Layer w0.254: v1(83.31,7.75) 80.37,7.75 v1(77.8,10.31)
$3N727: length 4.4
  Top Layer w0.254: U6.7 94.74,20.27 94.74,21.34 94.29,21.79 C21.1 94.29,24.32 L1.1
$3N732: length 4.3
  Top Layer w0.254: U6.6 96.01,20.27 96.01,21.34 96.24,21.56 96.24,22.47 C20.1 96.19,24.32 L1.2
$3N755: length 3.5
  Top Layer w0.254: R38.2 H1.2
$3N1277: length 62
  Top Layer w0.5: 118.87,26.03 113.4,26.03 112.76,26.67 112.76,26.92 ; 118.87,26.03 118.87,42.67 117.6,43.94 113.53,43.94 112.76,43.18 ; 118.87,26.03 118.87,23.88 ; RJ2.14 113.54,6.22 117.6,6.22 118.87,7.49 118.87,23.88 ; 118.87,23.88 118.75,24 113.64,24 112.89,23.26 RJ2.13
$3N1411: length 3.4
  Top Layer w0.254: RJ1.9 106.55,27.55 106.55,25.03 R42.1
$3N1537: length 9.1
  Top Layer w0.254: RJ1.11 109.22,41.65 109.22,46.61 108.84,46.99 R44.1
$3N1877: length 67.8
  Top Layer w0.254: v1(104.27,16.51) 113.89,16.51 RJ2.3 115.04,16.53 115.44,16.13 115.44,13.47 ; RJ2.6 115.44,13.47 ; 115.44,13.47 115.44,11.43 112.9,8.89 111.25,8.89 110.24,7.87 110.24,5.84 111.25,4.83 114.94,4.83 115.7,4.06 115.7,3.07 R41.2 ; RJ1.6 v1(104.27,33.52)
  Bottom Layer w0.254: RJ1.6 110.75,33.52 110.24,34.04 110.24,35.95 110.87,36.58 RJ1.3 ; v1(104.27,33.52) v1(104.27,16.51)
$3N1914: length 2.4
  Top Layer w0.254: C25.2 R41.1
$3N3836: length 65.6
  Top Layer w0.254: v1(43.56,20.45) 48.51,20.45 54.61,14.35 65.66,14.35 68.45,17.14 86.23,17.14 88.4,14.98 92.27,14.98 92.34,14.91 92.82,14.91 92.9,14.98 93.34,14.98 U6.1 ; R1.2 47.76,27.3 TP13.1 45.85,27.31 v1(43.69,27.31)
  Bottom Layer w0.254: v1(43.56,20.45) 43.56,27.18 v1(43.69,27.31)
$3N3869: length 76.9
  Top Layer w0.254: v1(42.16,28.96) 45.86,28.96 TP14.1 47.75,28.97 R37.2 ; v1(42.16,19.69) 47.5,19.69 54.1,13.08 66.17,13.08 69.09,16 84.84,16 88.39,12.45 95.63,12.45 97.28,14.1 97.28,14.85 U6.4
  Bottom Layer w0.254: v1(42.16,19.69) v1(42.16,28.96)
$3N3903: length 56.1
  Top Layer w0.254: v1(87.5,21.84) 91.57,21.84 91.95,21.46 91.95,20.37 R40.2 92.02,20.27 U6.8 ; TP15.1 62.7,40.12 R39.2 61.09,40.89 61.72,41.53 v1(87.5,41.53)
  Bottom Layer w0.254: v1(87.5,41.53) v1(87.5,21.84)
$3N3934: length 3.5
  Top Layer w0.254: RJ1.12 108.07,42.79 R43.1

## Copper pours and planes (outline as drawn; the poured copper is in the pictures)
+3V3 on Top Layer: 77.47,13.54 84.07,13.54 84.07,10.24 77.47,10.24
+3V3 on Bottom Layer: 77.47,13.59 84.07,13.59 84.07,10.29 77.47,10.29
+5V on Top Layer: 71.02,9.48 76.15,9.48 76.15,7.57 71.02,7.57
GND on Top Layer: 75.31,8.35 78.15,8.35 78.15,7.19 75.31,7.19
GND on Top Layer: 71.14,13.54 77.29,13.54 77.29,9.73 71.14,9.73
GND on Top Layer: -3.3,63.12 123.44,63.12 123.44,-1.4 -3.3,-1.4
GND on Bottom Layer: -4.44,65.02 124.71,65.02 124.71,-3.81 -4.44,-3.81
GND on Inner1: -6.98,65.41 126.37,65.41 126.37,-6.22 -6.98,-6.22
GND on Inner2: -12.06,69.72 128.27,69.72 128.27,-7.87 -12.06,-7.87
$1N53851 on Top Layer: 78.02,9.48 82.04,9.48 82.04,8.08 78.02,8.08

Small or netless copper shapes (teardrops, artwork), in the pictures only: 522 on Top Layer, 88 on Bottom Layer

## Text on the board
Bottom Silkscreen Layer: GND | SAL | SDA | SCL | SE | VBAT | 3V3 | 5V | 12V | BUSMASTER MAIN V101 | SEMANTIC BOAT PROJECT
Top Silkscreen Layer: 5V | GND | 3V3 | SWD | RS485 | EPROM | RESET | CAN-TRM | CAN-PWR | CAN / OUT | CAN-IN
